# Altium schematic sheet MCU.SchDoc
size A
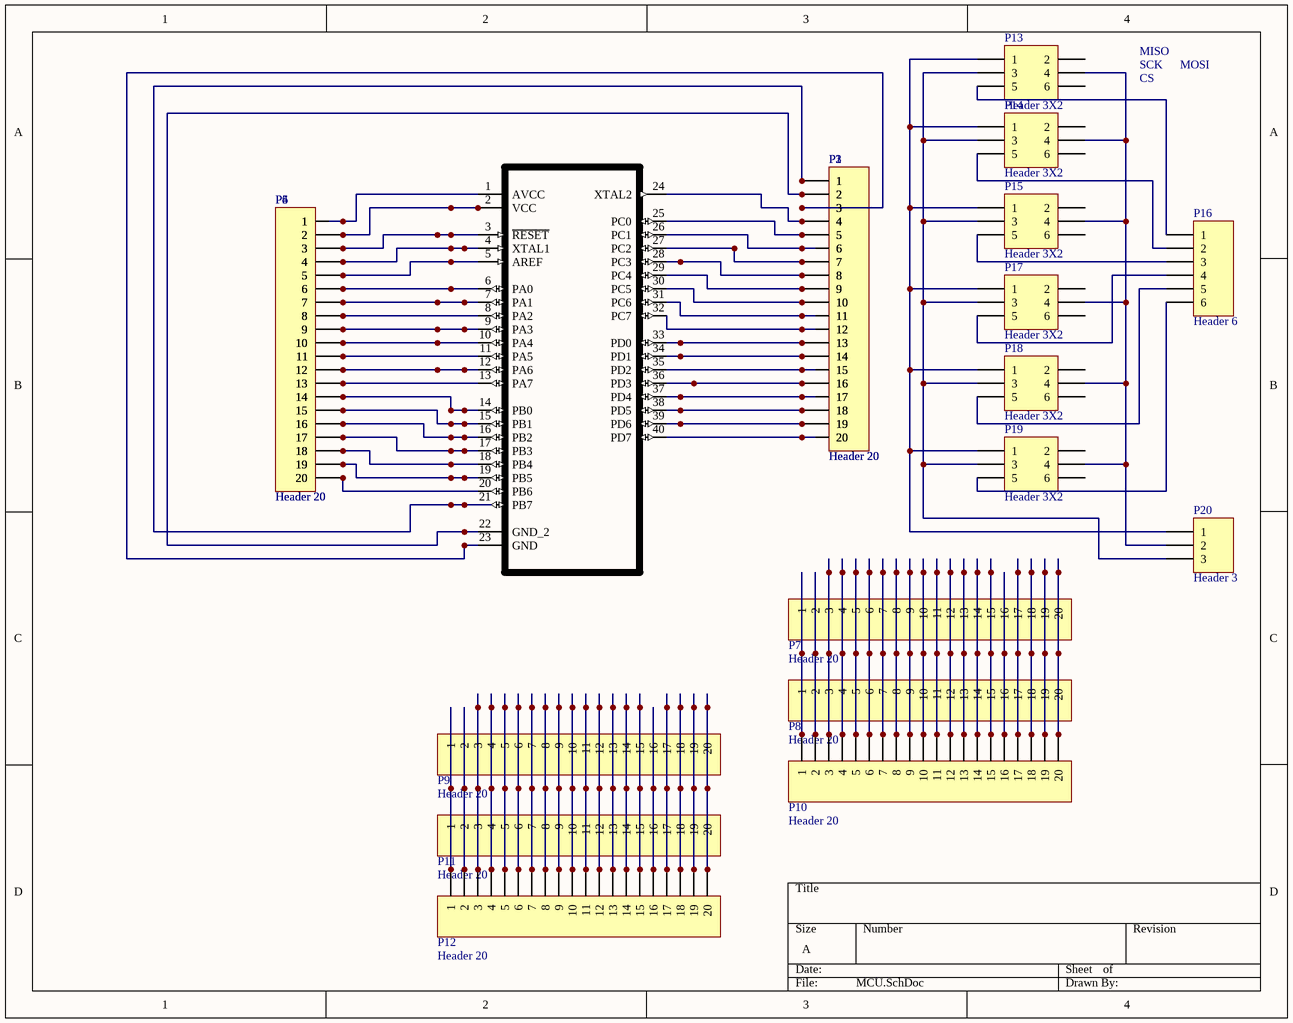
[diagram p0: MCU.SchDoc]

## Parts
P1  Header 20  [HDR1X20]
P2  Header 20  [HDR1X20]
P3  Header 20  [HDR1X20]
P4  Header 20  [HDR1X20]
P5  Header 20  [HDR1X20]
P6  Header 20  [HDR1X20]
P7  Header 20  [HDR1X20]
P8  Header 20  [HDR1X20]
P9  Header 20  [HDR1X20]
P10  Header 20  [HDR1X20]
P11  Header 20  [HDR1X20]
P12  Header 20  [HDR1X20]
P13  Header 3X2  [HDR2X3]
P14  Header 3X2  [HDR2X3]
P15  Header 3X2  [HDR2X3]
P16  Header 6  [HDR1X6]
P17  Header 3X2  [HDR2X3]
P18  Header 3X2  [HDR2X3]
P19  Header 3X2  [HDR2X3]
P20  Header 3  [HDR1X3]
U1  ATMEGA1284P-PU  [DIP254P1524X483-40_ATMEGA1284P-PU(Primary)]  (value not drawn)

## Nets
NetP1_1: P1.1 P2.1 P3.1 U1.21(PB7)
NetP1_2: P1.2 P2.2 P3.2 U1.22(GND_2)
NetP1_3: P1.3 P2.3 P3.3 U1.23(GND)
NetP1_4: P1.4 P2.4 P3.4 U1.24(XTAL2)
NetP1_5: P1.5 P2.5 P3.5 U1.25(PC0)
NetP1_6: P1.6 P2.6 P3.6 U1.26(PC1)
NetP1_7: P1.7 P2.7 P3.7 U1.27(PC2)
NetP1_8: P1.8 P2.8 P3.8 U1.28(PC3)
NetP1_9: P1.9 P2.9 P3.9 U1.29(PC4)
NetP1_10: P1.10 P2.10 P3.10 U1.30(PC5)
NetP1_11: P1.11 P2.11 P3.11 U1.31(PC6)
NetP1_12: P1.12 P2.12 P3.12 U1.32(PC7)
NetP1_13: P1.13 P2.13 P3.13 U1.33(PD0)
NetP1_14: P1.14 P2.14 P3.14 U1.34(PD1)
NetP1_15: P1.15 P2.15 P3.15 U1.35(PD2)
NetP1_16: P1.16 P2.16 P3.16 U1.36(PD3)
NetP1_17: P1.17 P2.17 P3.17 U1.37(PD4)
NetP1_18: P1.18 P2.18 P3.18 U1.38(PD5)
NetP1_19: P1.19 P2.19 P3.19 U1.39(PD6)
NetP1_20: P1.20 P2.20 P3.20 U1.40(PD7)
NetP4_1: P4.1 P5.1 P6.1 U1.1(AVCC)
NetP4_2: P4.2 P5.2 P6.2 U1.2(VCC)
NetP4_3: P4.3 P5.3 P6.3 U1.3(~{RESET})
NetP4_4: P4.4 P5.4 P6.4 U1.4(XTAL1)
NetP4_5: P4.5 P5.5 P6.5 U1.5(AREF)
NetP4_6: P4.6 P5.6 P6.6 U1.6(PA0)
NetP4_7: P4.7 P5.7 P6.7 U1.7(PA1)
NetP4_8: P4.8 P5.8 P6.8 U1.8(PA2)
NetP4_9: P4.9 P5.9 P6.9 U1.9(PA3)
NetP4_10: P4.10 P5.10 P6.10 U1.10(PA4)
NetP4_11: P4.11 P5.11 P6.11 U1.11(PA5)
NetP4_12: P4.12 P5.12 P6.12 U1.12(PA6)
NetP4_13: P4.13 P5.13 P6.13 U1.13(PA7)
NetP4_14: P4.14 P5.14 P6.14 U1.14(PB0)
NetP4_15: P4.15 P5.15 P6.15 U1.15(PB1)
NetP4_16: P4.16 P5.16 P6.16 U1.16(PB2)
NetP4_17: P4.17 P5.17 P6.17 U1.17(PB3)
NetP4_18: P4.18 P5.18 P6.18 U1.18(PB4)
NetP4_19: P4.19 P5.19 P6.19 U1.19(PB5)
NetP4_20: P4.20 P5.20 P6.20 U1.20(PB6)
NetP7_1: P7.1 P8.1 P10.1
NetP7_2: P7.2 P8.2 P10.2
NetP7_3: P7.3 P8.3 P10.3
NetP7_4: P7.4 P8.4 P10.4
NetP7_5: P7.5 P8.5 P10.5
NetP7_6: P7.6 P8.6 P10.6
NetP7_7: P7.7 P8.7 P10.7
NetP7_8: P7.8 P8.8 P10.8
NetP7_9: P7.9 P8.9 P10.9
NetP7_10: P7.10 P8.10 P10.10
NetP7_11: P7.11 P8.11 P10.11
NetP7_12: P7.12 P8.12 P10.12
NetP7_13: P7.13 P8.13 P10.13
NetP7_14: P7.14 P8.14 P10.14
NetP7_15: P7.15 P8.15 P10.15
NetP7_16: P7.16 P8.16 P10.16
NetP7_17: P7.17 P8.17 P10.17
NetP7_18: P7.18 P8.18 P10.18
NetP7_19: P7.19 P8.19 P10.19
NetP7_20: P7.20 P8.20 P10.20
NetP9_1: P9.1 P11.1 P12.1
NetP9_2: P9.2 P11.2 P12.2
NetP9_3: P9.3 P11.3 P12.3
NetP9_4: P9.4 P11.4 P12.4
NetP9_5: P9.5 P11.5 P12.5
NetP9_6: P9.6 P11.6 P12.6
NetP9_7: P9.7 P11.7 P12.7
NetP9_8: P9.8 P11.8 P12.8
NetP9_9: P9.9 P11.9 P12.9
NetP9_10: P9.10 P11.10 P12.10
NetP9_11: P9.11 P11.11 P12.11
NetP9_12: P9.12 P11.12 P12.12
NetP9_13: P9.13 P11.13 P12.13
NetP9_14: P9.14 P11.14 P12.14
NetP9_15: P9.15 P11.15 P12.15
NetP9_16: P9.16 P11.16 P12.16
NetP9_17: P9.17 P11.17 P12.17
NetP9_18: P9.18 P11.18 P12.18
NetP9_19: P9.19 P11.19 P12.19
NetP9_20: P9.20 P11.20 P12.20
NetP13_1: P13.1 P14.1 P15.1 P17.1 P18.1 P19.1 P20.1
NetP13_3: P13.3 P14.3 P15.3 P17.3 P18.3 P19.3 P20.3
NetP13_4: P13.4 P14.4 P15.4 P17.4 P18.4 P19.4 P20.2
NetP13_5: P13.5 P16.1
NetP14_5: P14.5 P16.2
NetP15_5: P15.5 P16.3
NetP16_4: P16.4 P17.5
NetP16_5: P16.5 P18.5
NetP16_6: P16.6 P19.5

Not connected (* = marked no-connect by the designer): P13 2 6; P14 2 6; P15 2 6; P17 2 6; P18 2 6; P19 2 6

## Notes on the sheet
- MISO
- SCK
- CS
- MOSI

## Library data of the parts
P1-P12 = Header 20: Header, 20-Pin; LatestRevisionDate: 17-Jul-2002; LatestRevisionNote: Re-released for DXP Platform.; Publisher: Altium Limited
P13-P15 P17-P19 = Header 3X2: Header, 3-Pin, Dual row; LatestRevisionDate: 17-Jul-2002; LatestRevisionNote: Re-released for DXP Platform.; Publisher: Altium Limited
P16 = Header 6: Header, 6-Pin; LatestRevisionDate: 17-Jul-2002; LatestRevisionNote: Re-released for DXP Platform.; Publisher: Altium Limited
P20 = Header 3: Header, 3-Pin; LatestRevisionDate: 17-Jul-2002; LatestRevisionNote: Re-released for DXP Platform.; Publisher: Altium Limited
U1 = ATMEGA1284P-PU: Value: *